# EAGLE design iCEHAX5U1K (EAGLE 9.7.0)

## Sheet 1 of 2: FPGA
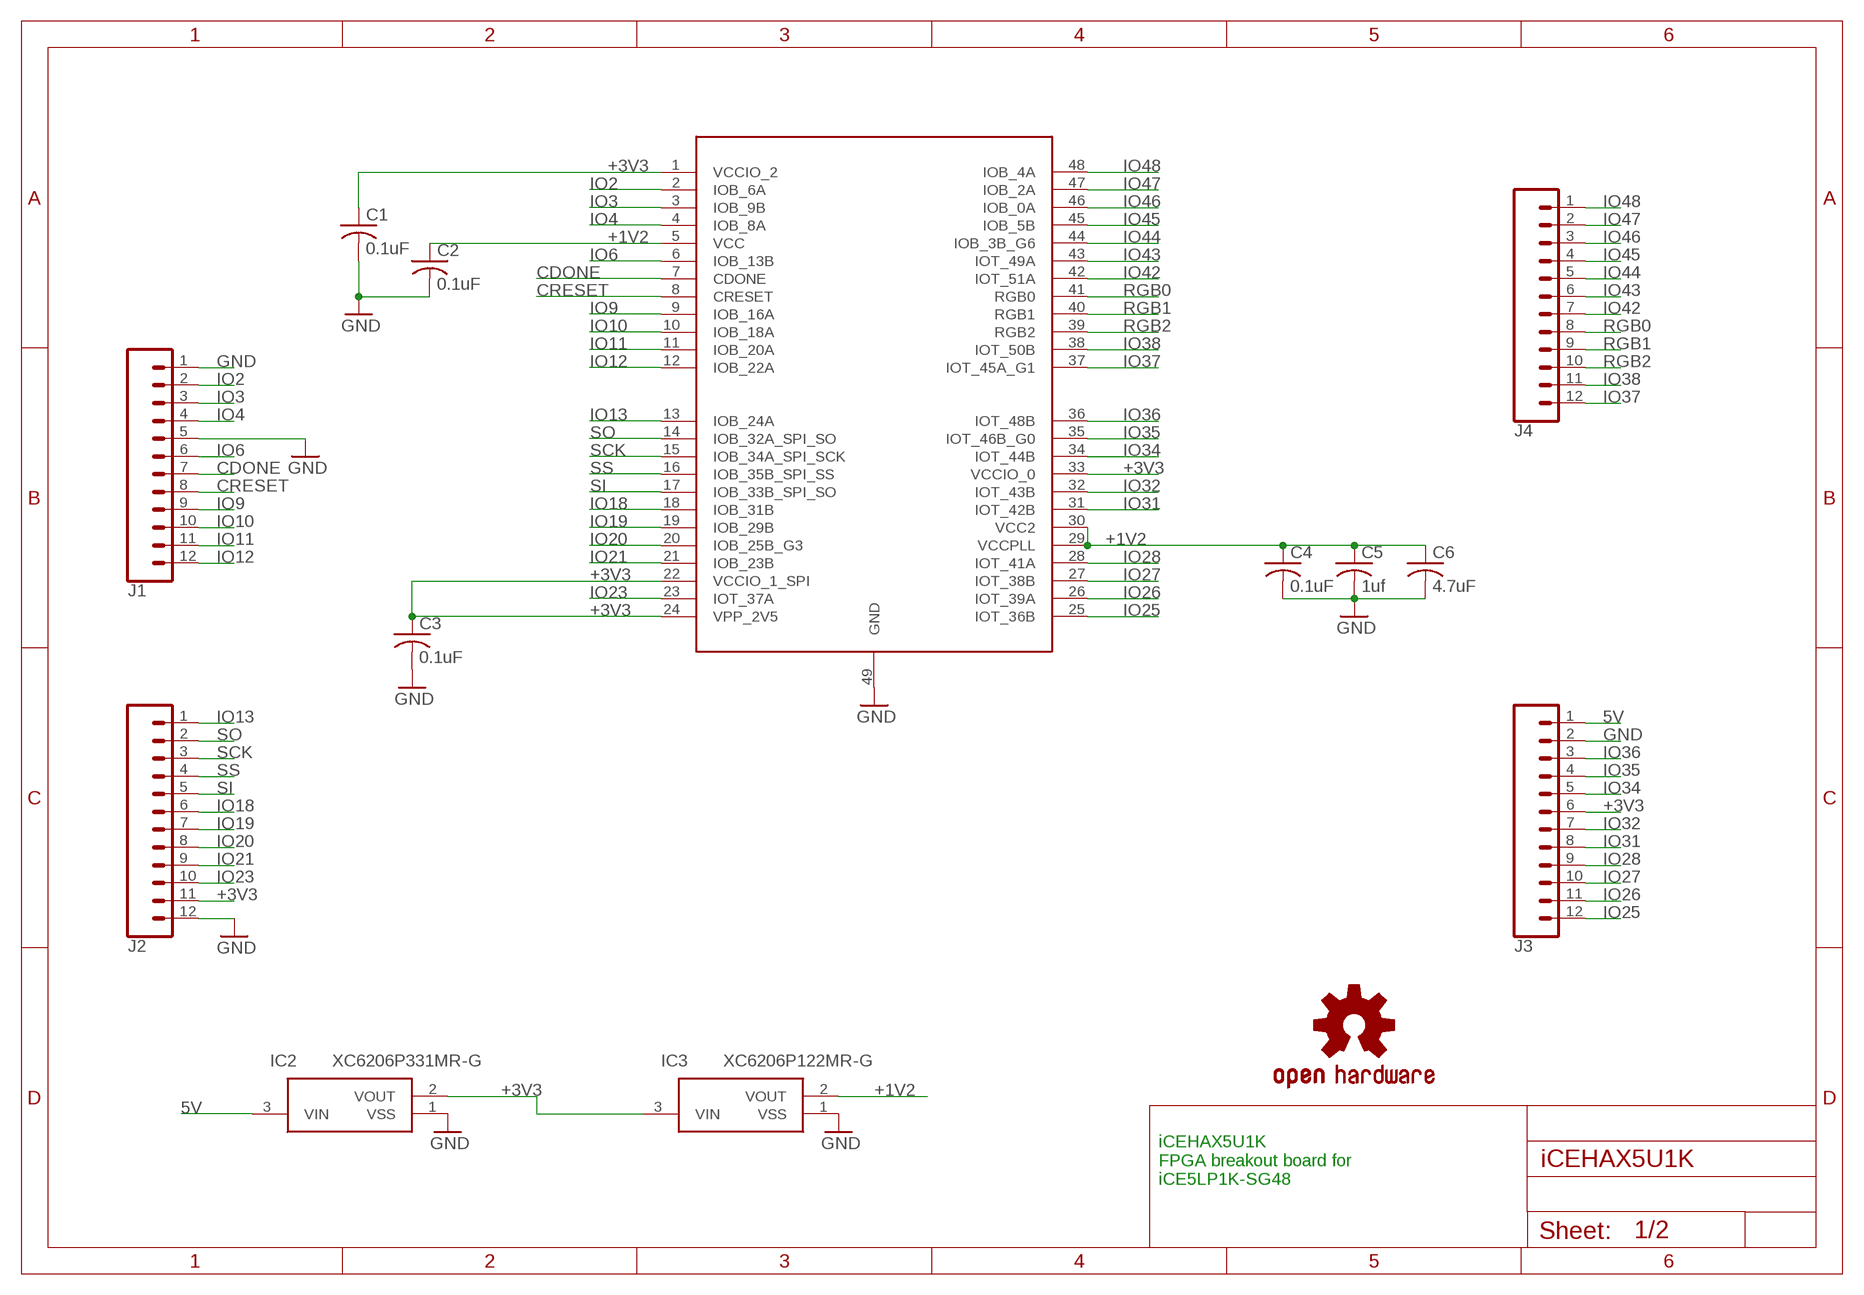
[diagram p0: schematic, sheet 1]

### Parts
C1  0.1uF  C-USC0603  [C0603]
C2  0.1uF  C-USC0603  [C0603]
C3  0.1uF  C-USC0603  [C0603]
C4  0.1uF  C-USC0603  [C0603]
C5  1uf  C-USC0603  [C0603]
C6  4.7uF  C-USC0603  [C0603]
IC1  ICE5LP1K-SG48  [QFN50P700X700X100-48T535N]
IC2  XC6206P331MR-G  [SOT95P280X130-3N]
IC3  XC6206P122MR-G  [SOT95P280X130-3N]
J1  CONN_12NO_SILK  [1X12_NO_SILK]
J2  CONN_12NO_SILK  [1X12_NO_SILK]
J3  CONN_12NO_SILK  [1X12_NO_SILK]
J4  CONN_12NO_SILK  [1X12_NO_SILK]
LOGO1  OSHW-LOGOMINI  [OSHW-LOGO-MINI]

### Nets
5V: IC2.3(VIN) J3.1 ; also sheet 2
+1V2: C2.1 C4.1 C5.1 C6.1 IC1.5(VCC) IC1.29(VCCPLL) IC1.30(VCC2) IC3.2(VOUT)
+3V3: C1.1 C3.1 IC1.1(VCCIO_2) IC1.22(VCCIO_1_SPI) IC1.24(VPP_2V5) IC1.33(VCCIO_0) IC2.2(VOUT) IC3.3(VIN) J2.11 J3.6 ; also sheet 2
CDONE: IC1.7(CDONE) J1.7
CRESET: IC1.8(CRESET) J1.8 ; also sheet 2
GND: C1.2 C2.2 C3.2 C4.2 C5.2 C6.2 IC1.49(GND) IC2.1(VSS) IC3.1(VSS) J1.1 J1.5 J2.12 J3.2 ; also sheet 2
IO2: IC1.2(IOB_6A) J1.2
IO3: IC1.3(IOB_9B) J1.3
IO4: IC1.4(IOB_8A) J1.4
IO6: IC1.6(IOB_13B) J1.6
IO9: IC1.9(IOB_16A) J1.9
IO10: IC1.10(IOB_18A) J1.10
IO11: IC1.11(IOB_20A) J1.11
IO12: IC1.12(IOB_22A) J1.12
IO13: IC1.13(IOB_24A) J2.1
IO18: IC1.18(IOB_31B) J2.6
IO19: IC1.19(IOB_29B) J2.7
IO20: IC1.20(IOB_25B_G3) J2.8
IO21: IC1.21(IOB_23B) J2.9
IO23: IC1.23(IOT_37A) J2.10
IO25: IC1.25(IOT_36B) J3.12
IO26: IC1.26(IOT_39A) J3.11
IO27: IC1.27(IOT_38B) J3.10
IO28: IC1.28(IOT_41A) J3.9
IO31: IC1.31(IOT_42B) J3.8
IO32: IC1.32(IOT_43B) J3.7
IO34: IC1.34(IOT_44B) J3.5
IO35: IC1.35(IOT_46B_G0) J3.4
IO36: IC1.36(IOT_48B) J3.3
IO37: IC1.37(IOT_45A_G1) J4.12
IO38: IC1.38(IOT_50B) J4.11
IO42: IC1.42(IOT_51A) J4.7
IO43: IC1.43(IOT_49A) J4.6
IO44: IC1.44(IOB_3B_G6) J4.5
IO45: IC1.45(IOB_5B) J4.4
IO46: IC1.46(IOB_0A) J4.3
IO47: IC1.47(IOB_2A) J4.2
IO48: IC1.48(IOB_4A) J4.1
RGB0: IC1.41(RGB0) J4.8
RGB1: IC1.40(RGB1) J4.9
RGB2: IC1.39(RGB2) J4.10
SCK: IC1.15(IOB_34A_SPI_SCK) J2.3 ; also sheet 2
SI: IC1.17(IOB_33B_SPI_SO) J2.5 ; also sheet 2
SO: IC1.14(IOB_32A_SPI_SO) J2.2 ; also sheet 2
SS: IC1.16(IOB_35B_SPI_SS) J2.4 ; also sheet 2

### Notes on the sheet
- iCEHAX5U1K
  FPGA breakout board for
  iCE5LP1K-SG48

## Sheet 2 of 2: iCEBlaster
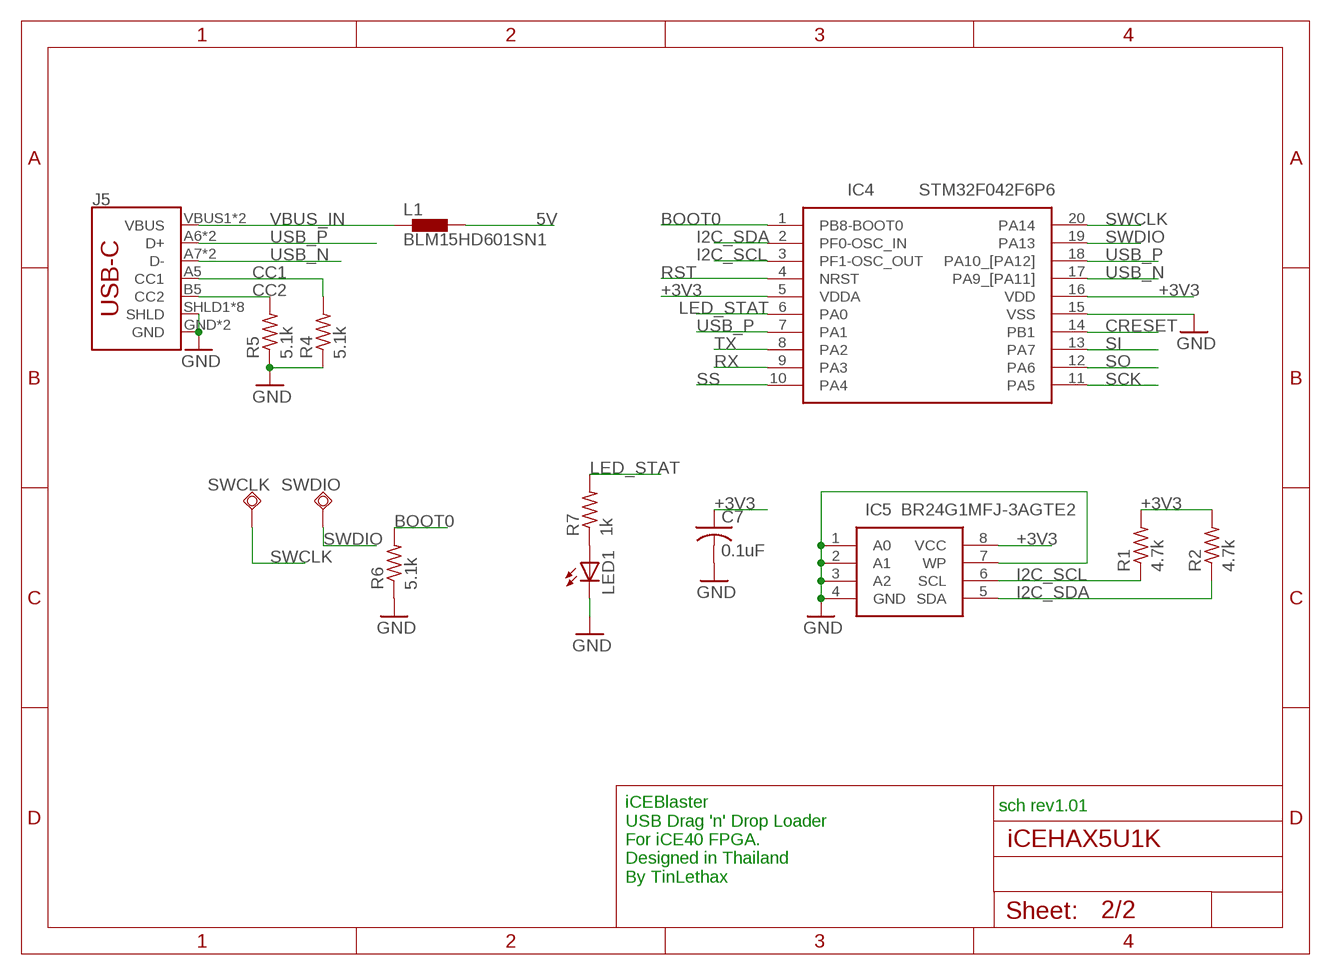
[diagram p1: schematic, sheet 2]

### Parts
C7  0.1uF  C-USC0603  [C0603]
IC4  STM32F042F6P6  [SOP65P640X120-20N]
IC5  BR24G1MFJ-3AGTE2  [SOP126P620X150-8N]
J5  SPARKFUN-CONNECTORS_USB_C16PIN  [SPARKFUN-CONNECTORS_USB-C-16P]
L1  BLM15HD601SN1  [0402]
LED1  LEDCHIP-LED0603  [CHIP-LED0603]
R1  4.7k  R-US_R0603  [R0603]
R2  4.7k  R-US_R0603  [R0603]
R4  5.1k  R-US_R0603  [R0603]
R5  5.1k  R-US_R0603  [R0603]
R6  5.1k  R-US_R0603  [R0603]
R7  1k  R-US_R0603  [R0603]
SWCLK  TPSQTP15SQ  [TP15SQ]
SWDIO  TPSQTP15SQ  [TP15SQ]

### Nets
5V: L1.2 ; also sheet 1
+3V3: C7.1 IC4.5(VDDA) IC4.16(VDD) IC5.8(VCC) R1.2 R2.2 ; also sheet 1
BOOT0: IC4.1(PB8-BOOT0) R6.2
CC1: J5.A5(CC1) R4.2
CC2: J5.B5(CC2) R5.2
CRESET: IC4.14(PB1) ; also sheet 1
GND: C7.2 IC4.15(VSS) IC5.1(A0) IC5.2(A1) IC5.3(A2) IC5.4(GND) IC5.7(WP) J5.GND J5.GND2(GND) J5.SHLD1(SHLD) J5.SHLD2(SHLD) J5.SHLD3(SHLD) J5.SHLD4(SHLD) J5.SHLD5(SHLD) J5.SHLD6(SHLD) J5.SHLD7(SHLD) J5.SHLD8(SHLD) LED1.C R4.1 R5.1 R6.1 ; also sheet 1
I2C_SCL: IC4.3(PF1-OSC_OUT) IC5.6(SCL) R1.1
I2C_SDA: IC4.2(PF0-OSC_IN) IC5.5(SDA) R2.1
LED: LED1.A R7.1
LED_STAT: IC4.6(PA0) R7.2
RST: IC4.4(NRST)
RX: IC4.9(PA3)
SCK: IC4.11(PA5) ; also sheet 1
SI: IC4.13(PA7) ; also sheet 1
SO: IC4.12(PA6) ; also sheet 1
SS: IC4.10(PA4) ; also sheet 1
SWCLK: IC4.20(PA14) SWCLK.TP
SWDIO: IC4.19(PA13) SWDIO.TP
TX: IC4.8(PA2)
USB_N: IC4.17(PA9_[PA11]) J5.A7(D-) J5.B7(D-)
USB_P: IC4.7(PA1) IC4.18(PA10_[PA12]) J5.A6(D+) J5.B6(D+)
VBUS_IN: J5.VBUS1(VBUS) J5.VBUS2(VBUS) L1.1

### Notes on the sheet
- sch rev1.01
- iCEBlaster
  USB Drag 'n' Drop Loader
  For iCE40 FPGA.
  Designed in Thailand
  By TinLethax

## Library data of the parts
C1-C7 = adafruit:C-US: CAPACITOR, American symbol
IC1 = iCE5LP1K-SG48ITR:ICE5LP1K-SG48
IC2 = XC6206P331MR-G:XC6206P331MR-G: LDO Voltage Regulators Source: Datasheet <https://www.torexsemi.com/file/xc6206/XC6206.pdf>; DESCRIPTION: LDO Voltage Regulators; HEIGHT: 1.3mm; MANUFACTURER_NAME: Torex; MANUFACTURER_PART_NUMBER: XC6206P331MR-G; MOUSER_PART_NUMBER: 865-XC6206P331MR-G; MOUSER_PRICE-STOCK: https://www.mouser.co.uk/ProductDetail/Torex-Semiconductor/XC6206P331MR-G?qs=AsjdqWjXhJ%252B7jjWBpr1yow%3D%3D
IC3 = XC6206P122MR-G:XC6206P122MR-G: LDO Voltage Regulators 1uA Low Quiescent 3 Terminal, Low ESR Cap. Compatible, Voltage Regulator Source: Datasheet <https://www.torexsemi.com/file/xc6206/XC6206.pdf>; DESCRIPTION: LDO Voltage Regulators 1uA Low Quiescent 3 Terminal, Low ESR Cap. Compatible, Voltage Regulator; HEIGHT: 1.3mm; MANUFACTURER_NAME: Torex; MANUFACTURER_PART_NUMBER: XC6206P122MR-G; MOUSER_PART_NUMBER: 865-XC6206P122MR-G; MOUSER_PRICE-STOCK: https://www.mouser.co.uk/ProductDetail/Torex-Semiconductor/XC6206P122MR-G?qs=AsjdqWjXhJ%2F35%2FU%2FZk2JYg%3D%3D
IC4 = STM32F042F6P6:STM32F042F6P6: 32-Bit MCU 32K Flash USB2.0 CAN TSSOP20 STMicroelectronics STM32F042F6P6, 32bit ARM Cortex M0 Microcontroller, 48MHz, 32 kB Flash, 20-Pin TSSOP Source: Datasheet <http://www.st.com/content/ccc/resource/technical/document/datasheet/52/ad/d0/80/e6/be/40/ad/DM00105814.pdf/files/DM00105814.pdf/jcr:content/translations/en.DM00105814.pdf>; ARROW_PART_NUMBER: STM32F042F6P6; ARROW_PRICE-STOCK: https://www.arrow.com/en/products/stm32f042f6p6/stmicroelectronics; DESCRIPTION: 32-Bit MCU 32K Flash USB2.0 CAN TSSOP20 STMicroelectronics STM32F042F6P6, 32bit ARM Cortex M0 Microcontroller, 48MHz, 32 kB Flash, 20-Pin TSSOP; HEIGHT: 1.2mm; MANUFACTURER_NAME: STMicroelectronics; MANUFACTURER_PART_NUMBER: STM32F042F6P6; MOUSER_PART_NUMBER: 511-STM32F042F6P6; MOUSER_PRICE-STOCK: https://www.mouser.co.uk/ProductDetail/STMicroelectronics/STM32F042F6P6?qs=4b8myOmUP%252BsTtpJfUMo83g%3D%3D
IC5 = BR24G1MFJ-3AGTE2:BR24G1MFJ-3AGTE2: ROHM BR24G1MFJ-3AGTE2 EEPROM Memory, 1Mbit, 1.7 5.5 V SOP-J 8-Pin Source: Datasheet <https://www.es.co.th/Schemetic/PDF/BR24GXXX-3A.PDF>; DESCRIPTION: ROHM BR24G1MFJ-3AGTE2 EEPROM Memory, 1Mbit, 1.7 5.5 V SOP-J 8-Pin; HEIGHT: 1.5mm; MANUFACTURER_NAME: ROHM Semiconductor; MANUFACTURER_PART_NUMBER: BR24G1MFJ-3AGTE2
J1-J4 = SparkFun-Connectors:CONN_12: Multi connection point. Often used as Generic Header-pin footprint for 0.1 inch spaced/style header connections On any of the 0.1 inch spaced packages, you can populate with these: Break Away Headers - Straight <https://www.sparkfun.com/products/116> (PRT-00116) Break Away Male Headers - Right Angle <https://www.sparkfun.com/products/553> (PRT-00553) Female Headers <https://www.sparkfun.com/products/115> (PRT-00115) Break Away Headers - Machine Pin <https://www.sparkfun.com/products/117> (PRT-00117) Break Away Female Headers - Swiss Machine Pin <https://www.sparkfun.com/products/743> (PRT-00743) For SCREWTERMINALS and SPRING TERMINALS visit here: Screw Terimnals on SparkFun.com <https://www.sparkfun.com/search/results?term=Screw+Terminals> (5mm/3.5mm/2.54mm spacing) This device is also useful as a general connection point to wire up your design to another part of your project. Our various solder wires solder well into these plated through hole pads. Hook-Up Wire - Assortment (Stranded, 22 AWG) <https://www.sparkfun.com/products/11375> (PRT-11375) Hook-Up Wire - Assortment (Solid Core, 22 AWG) <https://www.sparkfun.com/products/11367> (PRT-11367) View the entire wire category on our website here <https://www.sparkfun.com/categories/141> Special notes: Molex polarized connector foot print use with SKU : PRT-08231 with associated crimp pins and housings. 1MM SMD Version SKU: PRT-10208 NOTES ON THE VARIANTS LOCK and LOCK_LONGPADS... This footprint was designed to help hold the alignment of a through-hole component (i.e. 6-pin header) while soldering it into place. You may notice that each hole has been shifted either up or down by 0.005 of an inch from it's more standard position (which is a perfectly straight line). This slight alteration caused the pins (the squares in the middle) to touch the edges of the holes. Because they are alternating, it causes a "brace" to hold the component in place. 0.005 has proven to be the perfect amount of "off-center" position when using our standard breakaway headers. Although looks a little odd when you look at the bare footprint, once you have a header in there, the alteration is very hard to notice. Also,if you push a header all the way into place, it is covered up entirely on the bottom side.
J5 = USB-C-Breakout:SPARKFUN-CONNECTORS_USB_C: USB Type C 16Pin Connector Super Speed pins not available on the 16-pin purely SMD connector so this part is best for USB 2.0 implementations. D1 and D2 are tied together enabling D+/- no matter which way the cable is plugged into the connector. The two channel configuration pins (CC1/2) are exposed. These are normally connected to ground via 5.1k resistors but can be reconfigured for high current/high power applications.; PROD_ID: CONN-14122
L1 = inductors:BLM15H: EMIFIL (R) Chip Ferrite Bead for GHz Noise Source: http://www.murata.com/ Ferrite Bead BLM15H.pdf
LED1 = adafruit:LED: LED OSRAM: - CHIPLED LG R971, LG N971, LY N971, LG Q971, LY Q971, LO R971, LY R971 LH N974, LH R974 LS Q976, LO Q976, LY Q976 LO Q996 - Hyper CHIPLED LW Q18S LB Q993, LB Q99A, LB R99A - SideLED LS A670, LO A670, LY A670, LG A670, LP A670 LB A673, LV A673, LT A673, LW A673 LH A674 LY A675 LS A676, LA A676, LO A676, LY A676, LW A676 LS A679, LY A679, LG A679 - Hyper Micro SIDELED® LS Y876, LA Y876, LO Y876, LY Y876 LT Y87S - SmartLED LW L88C, LW L88S LB L89C, LB L89S, LG L890 LS L89K, LO L89K, LY L89K LS L896, LA L896, LO L896, LY L896 - TOPLED LS T670, LO T670, LY T670, LG T670, LP T670 LSG T670, LSP T670, LSY T670, LOP T670, LYG T670 LG T671, LOG T671, LSG T671 LB T673, LV T673, LT T673, LW T673 LH T674 LS T676, LA T676, LO T676, LY T676, LB T676, LH T676, LSB T676, LW T676 LB T67C, LV T67C, LT T67C, LS T67K, LO T67K, LY T67K, LW E67C LS E67B, LA E67B, LO E67B, LY E67B, LB E67C, LV E67C, LT E67C LW T67C LS T679, LY T679, LG T679 LS T770, LO T770, LY T770, LG T770, LP T770 LB T773, LV T773, LT T773, LW T773 LH T774 LS E675, LA E675, LY E675, LS T675 LS T776, LA T776, LO T776, LY T776, LB T776 LHGB T686 LT T68C, LB T68C - Hyper Mini TOPLED® LB M676 - Mini TOPLED Santana® LG M470 LS M47K, LO M47K, LY M47K Source: http://www.osram.convergy.de/
LOGO1 = SparkFun-Aesthetics:OSHW-LOGO: Open-Source Hardware (OSHW) Logo This logo indicates the piece of hardware it is found on incorporates a OSHW license and/or adheres to the definition of open source hardware found here: http://freedomdefined.org/OSHW
R1 R2 R4-R7 = adafruit:R-US_: RESISTOR, American symbol
SWCLK SWDIO = testpad:TPSQ: Test pad

## Board
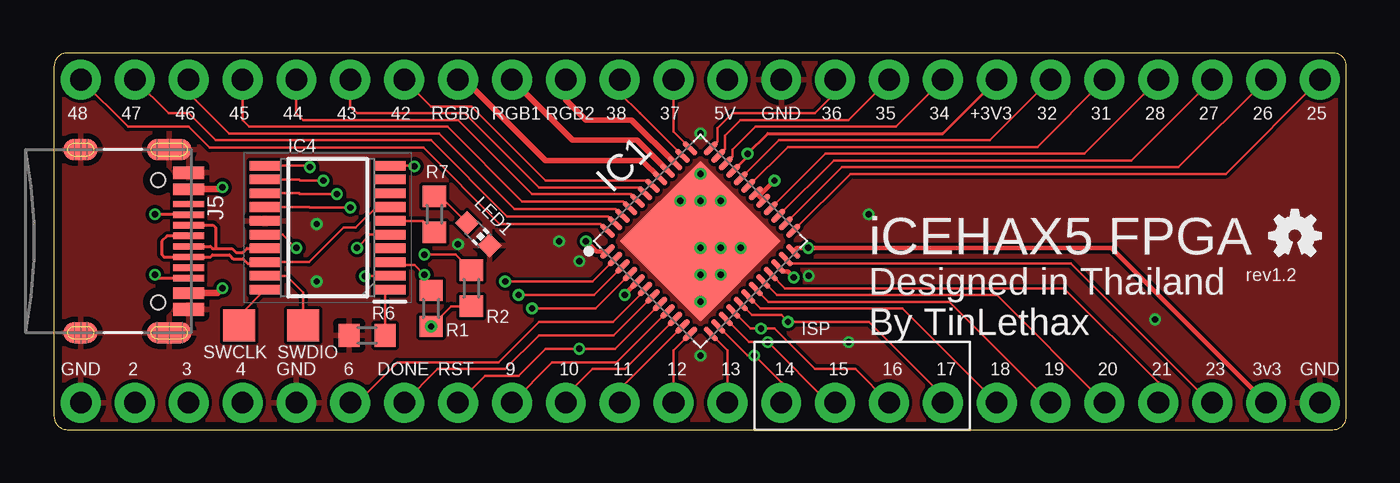
[diagram p2: board, top side]
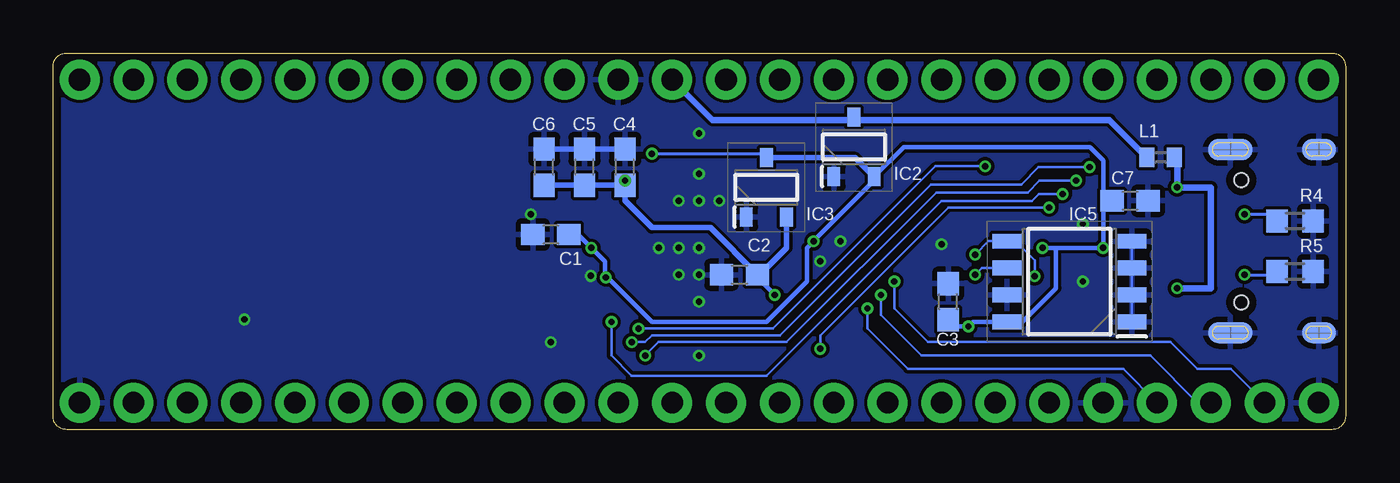
[diagram p3: board, bottom side, seen from below]

Size 60.94 x 17.77 mm. Coordinates in mm from the lower left corner, seen from the top.
Outline: 0,17.13 0,0.64 arc90 0.64,0 60.3,0 arc90 60.94,0.64 60.94,17.13 arc90 60.3,17.77 0.64,17.77 arc90 0,17.13
Copper layers (1*16): Top 0.035559375mm / dielectric 1.6mm / Bottom 0.035559375mm
Design rules "oshpark-2layer": minimum track width 6mil, minimum drill 10mil, track to track 6mil, track to pad 6mil, pad to pad 6mil, via to via 6mil, smd to smd 6mil, copper to edge 15mil, drill to drill 6mil, minimum pad ring 5mil, minimum via ring 5mil, stop-mask expansion 2.5mil, vias tented up to drill 0mil, thermal gap 10mil

### Footprints (pad centres in the part's own frame; a part is rotated, then mirrored left to right if it is on the bottom)
C0603 = smd 1.1 x 1: 1 -0.85,0; 2 0.85,0
QFN50P700X700X100-48T535N = smd 0.84 x 0.26: 1 -3.446,2.75; 2 -3.446,2.25; 3 -3.446,1.75; 4 -3.446,1.25; 5 -3.446,0.75; 6 -3.446,0.25; 7 -3.446,-0.25; 8 -3.446,-0.75; 9 -3.446,-1.25; 10 -3.446,-1.75; 11 -3.446,-2.25; 12 -3.446,-2.75; 25 3.446,-2.75; 26 3.446,-2.25; 27 3.446,-1.75; 28 3.446,-1.25; 29 3.446,-0.75; 30 3.446,-0.25; 31 3.446,0.25; 32 3.446,0.75; 33 3.446,1.25; 34 3.446,1.75; 35 3.446,2.25; 36 3.446,2.75 | smd 0.26 x 0.84: 13 -2.75,-3.446; 14 -2.25,-3.446; 15 -1.75,-3.446; 16 -1.25,-3.446; 17 -0.75,-3.446; 18 -0.25,-3.446; 19 0.25,-3.446; 20 0.75,-3.446; 21 1.25,-3.446; 22 1.75,-3.446; 23 2.25,-3.446; 24 2.75,-3.446; 37 2.75,3.446; 38 2.25,3.446; 39 1.75,3.446; 40 1.25,3.446; 41 0.75,3.446; 42 0.25,3.446; 43 -0.25,3.446; 44 -0.75,3.446; 45 -1.25,3.446; 46 -1.75,3.446; 47 -2.25,3.446; 48 -2.75,3.446 | smd 5.35 x 5.35: 49 0,0
SOT95P280X130-3N = smd 0.9 x 0.6: 1 -1.4,0.95; 2 -1.4,-0.95; 3 1.4,0
SOP65P640X120-20N = smd 1.475 x 0.45: 1 -2.938,2.925; 2 -2.938,2.275; 3 -2.938,1.625; 4 -2.938,0.975; 5 -2.938,0.325; 6 -2.938,-0.325; 7 -2.938,-0.975; 8 -2.938,-1.625; 9 -2.938,-2.275; 10 -2.938,-2.925; 11 2.938,-2.925; 12 2.938,-2.275; 13 2.938,-1.625; 14 2.938,-0.975; 15 2.938,-0.325; 16 2.938,0.325; 17 2.938,0.975; 18 2.938,1.625; 19 2.938,2.275; 20 2.938,2.925
SOP126P620X150-8N = smd 1.35 x 0.7: 1 -2.95,1.898; 2 -2.95,0.632; 3 -2.95,-0.632; 4 -2.95,-1.898; 5 2.95,-1.898; 6 2.95,-0.632; 7 2.95,0.632; 8 2.95,1.898
1X12_NO_SILK = drill 1.016 pad 1.88: 1 0,0; 2 2.54,0; 3 5.08,0; 4 7.62,0; 5 10.16,0; 6 12.7,0; 7 15.24,0; 8 17.78,0; 9 20.32,0; 10 22.86,0; 11 25.4,0; 12 27.94,0
SPARKFUN-CONNECTORS_USB-C-16P = smd 0.3 x 1.45: A5 -1.25,0; A6 -0.25,0; A7 0.25,0; A8 1.25,0; B5 1.75,0; B6 0.75,0; B7 -0.75,0; B8 -1.75,0 | smd 0.6 x 1.45: GND -3.225,0; GND2 3.225,0 | smd 1 x 2.1: SHLD1 -4.32,-0.915; SHLD2 4.32,-0.915 | smd 1 x 2.1 bottom: SHLD3 -4.32,-0.915; SHLD4 4.32,-0.915 | smd 1 x 1.6: SHLD5 -4.32,-5.095; SHLD8 4.32,-5.095 | smd 1 x 1.6 bottom: SHLD6 -4.32,-5.095; SHLD7 4.32,-5.095 | smd 0.55 x 1.45: VBUS1 -2.45,0; VBUS2 2.45,0 | hole 0.65: -2.89,-1.445; 2.89,-1.445
0402 = smd 0.7 x 0.9: 1 -0.65,0; 2 0.65,0
CHIP-LED0603 = smd 0.8 x 0.8: A 0,-0.75; C 0,0.75
R0603 = smd 1 x 1.1: 1 -0.85,0; 2 0.85,0
TP15SQ = smd 1.5 x 1.5: TP 0,0

### Placement (x,y rotation side)
C1  37.47,9.21 180 bottom
C2  28.57,7.3 180 bottom
C3  18.73,6.03 90 bottom
C4  33.97,12.38 90 bottom
C5  35.88,12.38 90 bottom
C6  37.78,12.38 90 bottom
C7  10.16,10.79 0 bottom
IC1  30.48,8.89 45 top
IC2  23.18,13.34 90 bottom
IC3  27.3,11.43 90 bottom
IC4  12.9,9.53 180 top
IC5  13.02,6.99 180 bottom
J1  1.27,1.27 0 top
J2  31.75,1.27 0 top
J3  31.75,16.51 0 top
J4  1.27,16.51 0 top
J5  6.35,8.89 270 top
L1  8.72,12.84 180 bottom
LED1  20,9.21 225 top
LOGO1  58.51,9.16 0 top
R1  17.78,5.71 270 top
R2  19.68,6.67 270 top
R4  2.38,9.84 180 bottom
R5  2.38,7.46 180 bottom
R6  14.76,4.45 0 top
R7  17.94,10.16 270 top
SWCLK  8.73,4.92 0 top
SWDIO  11.75,4.92 0 top

### Tracks (layer width: path | path; a pad name or v marks a point on that pad's centre or on a via)
5V
  Bottom 0.254: 23.5,14.61 23.31,14.61 IC2.3
  Bottom 0.305: L1.2 11.13,14.61 23.5,14.61 29.84,14.61 J3.1
+1V2  (via drill 0.3)
  Top 0.127: 26.91,6.38 v26.91,6.35 | 33.23,11.01
  Top 0.203: IC1.5 26.91,6.38 | v33.97,11.75 33.23,11.01 | 33.23,11.01 IC1.30 | IC1.30 | 33.23,11.01 IC1.29 | IC1.29
  Bottom 0.127: C4.1 v33.97,11.75
  Bottom 0.203: v26.91,6.35 v26.91,6.36 27.74,7.19 | 27.67,7.25 C2.1
  Bottom 0.254: C6.1 C5.1 34.19,11.53 v33.97,11.75 33.97,10.79 32.7,9.53 29.95,9.53 C2.1 | IC3.2 26.36,8.57 27.67,7.25 27.74,7.19
+3V3  (via drill 0.3)
  Top 0.127: IC4.5 14.91,9.2 v14.29,8.57 | v11.43,8.57 11.4,8.57 10.78,9.2 IC4.16 | R1.2 18.73,5.82 R2.2
  Top 0.152: J3.6 41.91,13.97 33.66,13.97 v32.7,13.02 32.7,12.88 IC1.33
  Top 0.203: IC1.1 25.57,8.4 v25.08,8.89 | IC1.24 35.03,8.57 v35.56,8.57 49.85,8.57 J2.11 | IC1.22 34.15,7.68 34.38,7.46 34.6,7.46 v34.87,7.18
  Bottom 0.127: v14.29,8.57 13.65,8.57 v11.43,8.57
  Bottom 0.152: 11.01,11.01 C7.1 11.43,10.79 | v32.7,13.02 27.49,13.02 IC3.3
  Bottom 0.203: 13.65,8.57 13.65,6.67 15.23,5.09 IC5.8 17.56,5.09 R1.2 18.41,4.87 C3.1 | v14.29,8.57 v11.43,8.57 11.43,10.79 11.43,12.7 12.06,13.34 20.83,13.34 IC2.2 22.23,11.74 v25.08,8.89 25.4,8.57 25.4,6.99 27.3,5.08 32.7,5.08 34.87,7.25 | C1.1 36.2,9.21 v35.56,8.57 34.92,7.94 34.92,7.3 34.87,7.25 | v34.87,7.18 34.87,7.25
  Bottom 0.254: IC2.2 23.12,12.83 IC3.3
  other vias: 17.78,4.87
BOOT0
  Top 0.127: R6.2 15.61,6.37 IC4.1
CC1  (via drill 0.3)
  Top 0.152: J5.A5 4.78,10.14 v4.76,10.16
  Bottom 0.152: v4.76,10.16 3.55,10.16 R4.2
CC2  (via drill 0.3)
  Top 0.152: J5.B5 4.92,7.14 v4.76,7.3
  Bottom 0.152: v4.76,7.3 3.39,7.3 R5.2
CDONE
  Top 0.127: IC1.7 26.39,4.45 22.86,4.45 21.27,2.86 18.1,2.86 J1.7
CRESET  (via drill 0.3)
  Top 0.127: IC4.14 12.04,10.5 12.06,10.48 v13.97,10.48 | IC1.8 26.46,3.81 v24.77,3.81 23.18,3.81 21.91,2.54 20.32,2.54 J1.8
  Bottom 0.127: v13.97,10.48 18.73,10.48 24.77,4.45 v24.77,3.81
GND  (via drill 0.3)
  Bottom 0.127: IC5.4 IC5.3 IC5.2 IC5.1
  Bottom 0.254: C4.2 C5.2 C6.2
  other vias: 30.48,12.06 30.48,10.79 30.48,6.03 30.48,7.3 30.48,8.57 31.43,10.79 29.53,10.79 31.43,8.57 32.38,8.57 31.43,7.3 12.38,6.99 37.47,4.13 35.59,7.25 51.92,5.19 30.48,3.49 38.42,10.16 23.81,8.89 24.77,7.94 30.48,13.97 19.05,8.75 12.38,9.7
  pour Top: 0.1,0.1 60.86,0.1 60.86,17.68 0.1,17.68
  pour Bottom: 0.1,0.1 60.86,0.1 60.86,17.68 0.1,17.68
I2C_SCL  (via drill 0.3)
  Top 0.127: IC4.3 15.98,7.76 17,7.76 v17.46,7.3 17.46,6.88 R1.1
  Bottom 0.127: v17.46,7.3 17.15,7.62 IC5.6
I2C_SDA  (via drill 0.3)
  Top 0.127: 15.89,7.3 IC4.2 v14.67,7.25 v14.66,7.24 | v17.46,8.26 18.95,8.26 R2.1
  Bottom 0.127: v17.46,8.26 16.83,8.89 IC5.5 | IC5.5 | v14.66,7.24 14.66,7.99 15.56,8.89 IC5.5
IO2  (via drill 0.3)
  Top 0.127: v21.27,6.99 25.39,6.99 IC1.2
  Bottom 0.127: J1.2 5.4,2.86 6.99,2.86 8.26,4.13 19.68,4.13 21.27,5.71 v21.27,6.99
IO3  (via drill 0.3)
  Top 0.127: IC1.3 25.46,6.35 v21.91,6.35
  Bottom 0.127: v21.91,6.35 21.91,5.4 20,3.49 9.21,3.49 6.99,1.27 J1.3
IO4  (via drill 0.3)
  Top 0.127: IC1.4 25.54,5.71 v22.54,5.71
  Bottom 0.127: v22.54,5.71 22.54,4.76 20.64,2.86 10.48,2.86 J1.4
IO6
  Top 0.127: J1.6 14.29,1.27 16.19,3.17 20.95,3.17 22.86,5.08 26.35,5.08 27.87,6.59 IC1.6
IO9
  Top 0.127: IC1.9 26.53,3.17 23.5,3.17 J1.9
IO10
  Top 0.127: IC1.10 26.92,2.86 25.4,2.86 24.13,1.59 J1.10
IO11
  Top 0.127: IC1.11 26.67,1.9 J1.11
IO12
  Top 0.127: IC1.12 29.21,3.73 J1.12
IO13
  Top 0.127: IC1.13 31.75,3.73 J2.1
IO18
  Top 0.127: IC1.18 33.3,5.71 40.01,5.71 J2.6
IO19
  Top 0.127: IC1.19 33.69,6.03 42.23,6.03 J2.7
IO20
  Top 0.127: IC1.20 34.08,6.35 44.45,6.35 J2.8
IO21
  Top 0.127: IC1.21 34.47,6.67 47.62,6.67 52.07,2.22 J2.9
IO23
  Top 0.127: J2.10 54.52,1.27 47.94,7.85 34.7,7.85 IC1.23
IO25
  Top 0.127: IC1.25 37.54,12.06 55.24,12.06 J3.12
IO26
  Top 0.127: IC1.26 37.15,12.38 53.02,12.38 J3.11
IO27
  Top 0.127: IC1.27 36.77,12.7 50.8,12.7 J3.10
IO28
  Top 0.127: IC1.28 36.38,13.02 48.58,13.02 J3.9
IO31
  Top 0.127: IC1.31 32.78,11.5 34.61,13.34 46.35,13.34 J3.8
IO32
  Top 0.127: IC1.32 34.18,13.65 44.13,13.65 J3.7
IO34
  Top 0.127: IC1.34 32,12.88 32,13.2 33.09,14.29 39.69,14.29 J3.5
IO35
  Top 0.127: IC1.35 31.64,13.23 31.64,13.87 32.38,14.61 37.47,14.61 J3.4
IO36
  Top 0.127: IC1.36 31.29,13.59 31.29,14.22 31.99,14.92 35.88,14.92 36.83,15.88 J3.3
IO37
  Top 0.127: IC1.37 29.21,14.05 J4.12
IO38
  Top 0.127: IC1.38 27.63,14.92 27.62,14.92 26.67,15.88 J4.11
IO42
  Top 0.127: J4.7 17.78,15.24 19.68,15.24 23.18,11.75 27.98,11.75 IC1.42
IO43
  Top 0.127: J4.6 13.97,15.24 14.29,14.92 19.37,14.92 22.86,11.43 27.59,11.43 IC1.43
IO44
  Top 0.127: J4.5 11.43,14.92 11.75,14.61 19.05,14.61 22.54,11.11 27.2,11.11 IC1.44
IO45
  Top 0.127: J4.4 8.89,14.61 9.21,14.29 18.55,14.29 22.08,10.76 26.84,10.76 IC1.45
IO46
  Top 0.127: IC1.46 26.49,10.41 21.73,10.41 18.16,13.97 8.26,13.97 6.35,15.88 J4.3
IO47
  Top 0.127: J4.2 5.4,14.92 6.35,14.92 7.62,13.65 17.78,13.65 21.37,10.05 26.14,10.05 IC1.47
IO48
  Top 0.127: J4.1 3.49,14.29 6.35,14.29 7.34,13.29 17.42,13.29 21.02,9.7 25.78,9.7 IC1.48
LED
  Top 0.127: R7.1 18.2,11.01 LED1.A | LED1.A
LED_STAT
  Top 0.127: R7.2 17.4,9.85 IC4.6
RGB0
  Top 0.254: IC1.41 27.73,12.7 23.18,12.7 19.37,16.51 J4.8
RGB1
  Top 0.254: J4.9 24.45,13.65 27.48,13.65 IC1.40
RGB2
  Top 0.254: IC1.39 27.24,14.61 25.08,14.61 24.13,15.56 J4.10
SCK  (via drill 0.3)
  Top 0.127: v12.06,12.38 12,12.45 IC4.11 | IC1.15 32.77,4.13 v33.66,4.13 36.51,1.27 J2.3
  Bottom 0.127: v12.06,12.38 14.48,12.38 15.29,11.57 19.55,11.57 26.67,4.45 32.7,4.45 33.02,4.13 v33.66,4.13
SI  (via drill 0.3)
  Top 0.127: IC4.13 11.55,11.15 11.59,11.11 v13.34,11.11 | IC1.17 32.91,5.4 34.29,5.4 v34.61,5.08 38.42,5.08 41.91,1.59 J2.5
  Bottom 0.127: v13.34,11.11 14.45,11.11 14.78,10.78 19.06,10.78 27.3,2.54 33.66,2.54 34.61,3.49 v34.61,5.08
SO  (via drill 0.3)
  Top 0.127: IC4.12 11.55,11.8 11.61,11.75 v12.7,11.75 | IC1.14 32.7,3.49 v33.02,3.49 34.29,2.22 J2.2
  Bottom 0.127: v12.7,11.75 14.43,11.75 14.99,11.19 19.29,11.19 26.35,4.13 32.38,4.13 v33.02,3.49
SS  (via drill 0.3)
  Top 0.127: IC1.16 32.84,4.76 v33.34,4.76 33.97,4.76 35.88,2.86 37.78,2.86 J2.4 | v16.99,12.42 16.97,12.45 IC4.10
  Bottom 0.127: v16.99,12.42 19.33,12.42 26.99,4.76 v33.34,4.76
SWCLK
  Top 0.127: IC4.20 8.73,5.37 SWCLK.TP
SWDIO
  Top 0.127: IC4.19 10.96,7.25 11.75,6.46 SWDIO.TP
USB_N
  Top 0.152: J5.A7 7.38,8.64 7.48,8.54 7.62,8.54 | 9.58,8.46 9.67,8.55 IC4.17 9.11,8.55 8.91,8.36 8.58,8.36 8.4,8.54 7.62,8.54 | J5.B7 7.5,9.64 7.62,9.53 7.62,8.54
USB_P
  Top 0.127: IC4.7 15.21,10.5 14.23,9.53 13.65,9.53 12.03,7.9 IC4.18
  Top 0.152: 9.91,7.95 IC4.18 10.04,7.83 9.14,7.83 8.91,8.05 8.46,8.05 8.27,8.24 7.48,8.24 7.38,8.14 J5.B6 5.2,8.14 5.08,8.26 5.08,8.89 5.33,9.14 J5.A6
VBUS_IN  (via drill 0.3)
  Top 0.305: J5.VBUS2 7.71,6.44 v7.94,6.67 | v7.94,11.43 7.85,11.34 J5.VBUS1
  Bottom 0.305: v7.94,6.67 6.35,6.67 6.35,11.43 v7.94,11.43 7.94,12.71 L1.1

### Text on the board
tPlace: ISP
tNames: 48 | 47 | 46 | 45 | 44 | 43 | 42 | RGB0 | RGB1 | RGB2 | 38 | 37 | 5V | GND | 36 | 35 | 34 | +3V3 | 32 | 31 | 28 | 27 | 26 | 25 | iCEHAX5 FPGA | rev1.2 | Designed in Thailand / By TinLethax | GND | 2 | 3 | 4 | GND | 6 | DONE | RST | 9 | 10 | 11 | 12 | 13 | 14 | 15 | 16 | 17 | 18 | 19 | 20 | 21 | 23 | 3v3 | GND